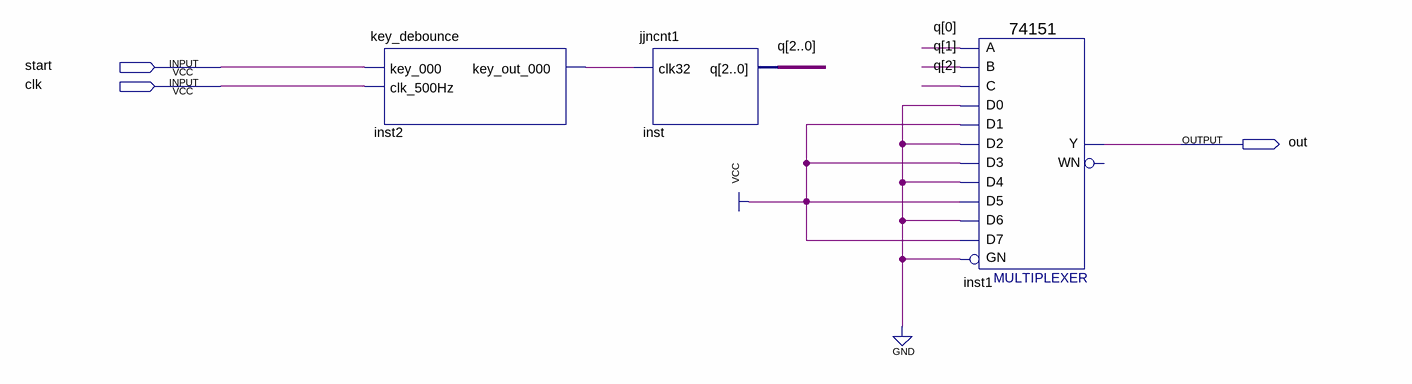
[diagram p0: schematic sheet]
// Quartus schematic start_end.bdf as structural Verilog: 3 symbols, 3 pins
module start_end (
  input  start,
  input  clk,
  output out
);

  wire inst2_key_out_000;
  wire [2:0] q;

  key_debounce inst2 (.key_000(start), .clk_500Hz(clk), .key_out_000(inst2_key_out_000));
  jjncnt1 inst (.clk32(inst2_key_out_000), .q(q));
  \74151  inst1 (
    .GN(1'b0), .C(q[2]), .B(q[1]), .A(q[0]), .D5(1'b1), .D0(1'b0), .D1(1'b1), .D4(1'b0), .D3(1'b1),
    .D2(1'b0), .D6(1'b0), .D7(1'b1), .Y(out));  // open: WN
endmodule
